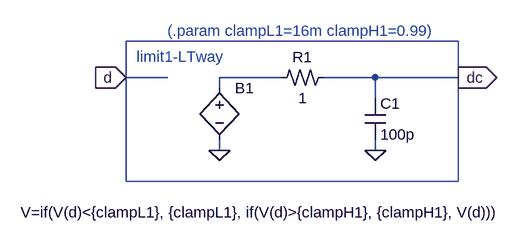
[diagram p0: schematic limit1.asc]
limit1.asc, the LTspice schematic file:
Version 4
SHEET 1 2260 2504
WIRE 0 112 -64 112
WIRE 176 112 80 112
WIRE 320 112 240 112
WIRE 448 112 320 112
WIRE 80 128 80 112
WIRE 320 144 320 112
WIRE 80 224 80 208
WIRE 320 224 320 208
FLAG -64 112 d
IOPIN -64 112 In
FLAG 448 112 dc
IOPIN 448 112 Out
FLAG 80 224 0
FLAG 320 224 0
SYMBOL bv 80 112 R0
WINDOW 3 -306 208 Left 0
SYMATTR Value V=if(V(d)<{clampL1}, {clampL1}, if(V(d)>{clampH1}, {clampH1}, V(d)))
SYMATTR InstName B1
SYMBOL cap 304 144 R0
SYMATTR InstName C1
SYMATTR Value 100p
SYMBOL res2 240 96 R90
WINDOW 0 0 32 VBottom 0
WINDOW 3 32 32 VTop 0
SYMATTR InstName R1
SYMATTR Value 1
TEXT -48 80 Left 0 ;limit1-LTway
TEXT 0 40 Left 0 ;(.param clampL1=16m clampH1=0.99)
RECTANGLE Normal 448 272 -64 56

The netlist it stands for:
* limit1.asc
B1 N001 0 V=if(V(d)<{clampL1}, {clampL1}, if(V(d)>{clampH1}, {clampH1}, V(d)))
C1 dc 0 100p
R1 dc N001 1
* limit1-LTway
* (.param clampL1=16m clampH1=0.99)
.backanno
.end